# Altium project HolderDog.PrjPcb
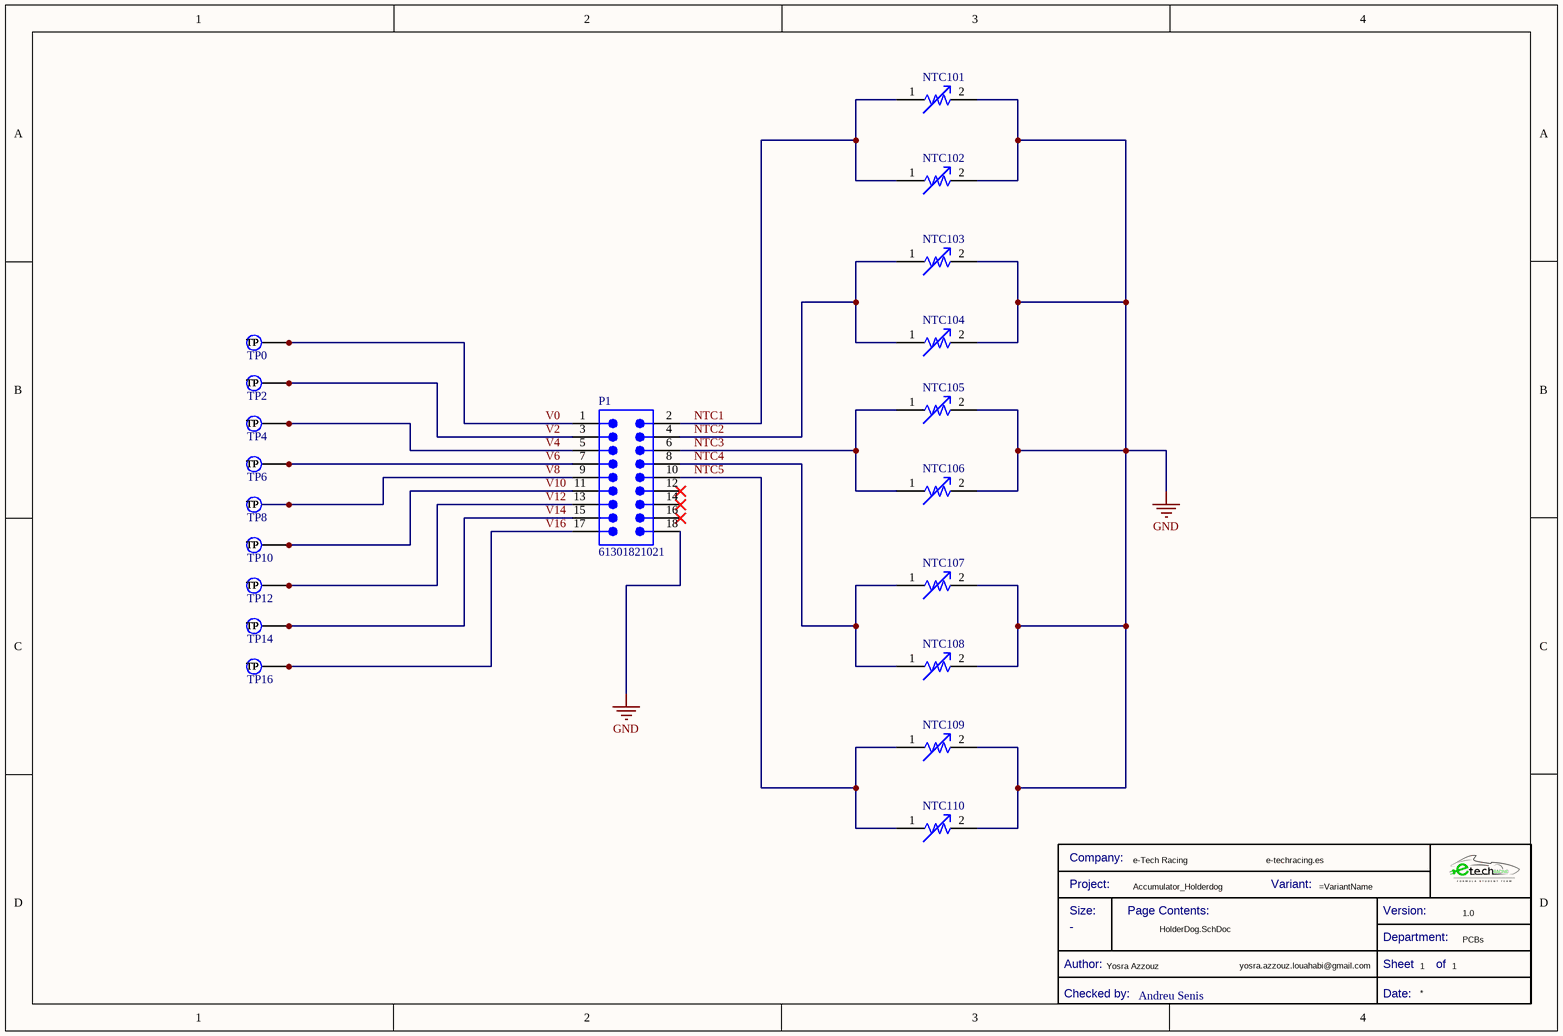
[diagram p0: HolderDog.SchDoc]
Company: e-Tech Racing; Department: PCBs; DesignedByURL: e-techracing.es; DesignerMail: yosra.azzouz.louahabi@gmail.com; DesignerName: Yosra Azzouz; Project: Accumulator_Holderdog; ReviewerName: Andreu Senis; Version: 1.0
1 sheet, 21 parts. Net scope: global (net labels, ports and power ports of the same name join across sheets).
Board file: HolderDog.PcbDoc

## Sheet HolderDog.SchDoc
size A4; SheetNumber: 1; SheetTotal: 1

### Parts
*  Checked by:: Andreu Senis  (hidden comment: Title Block_template)  (graphical)
NTC101  NTC SMD 0805  [RESC2012X10N]  (value not drawn)
NTC102  NTC SMD 0805  [RESC2012X10N]  (value not drawn)
NTC103  NTC SMD 0805  [RESC2012X10N]  (value not drawn)
NTC104  NTC SMD 0805  [RESC2012X10N]  (value not drawn)
NTC105  NTC SMD 0805  [RESC2012X10N]  (value not drawn)
NTC106  NTC SMD 0805  [RESC2012X10N]  (value not drawn)
NTC107  NTC SMD 0805  [RESC2012X10N]  (value not drawn)
NTC108  NTC SMD 0805  [RESC2012X10N]  (value not drawn)
NTC109  NTC SMD 0805  [RESC2012X10N]  (value not drawn)
NTC110  NTC SMD 0805  [RESC2012X10N]  (value not drawn)
P1  61301821021  [61301821021]
TP0  Test Point  [TESTPOINT_WIDE]  (value not drawn)
TP2  Test Point  [TESTPOINT_WIDE]  (value not drawn)
TP4  Test Point  [TESTPOINT_WIDE]  (value not drawn)
TP6  Test Point  [TESTPOINT_WIDE]  (value not drawn)
TP8  Test Point  [TESTPOINT_WIDE]  (value not drawn)
TP10  Test Point  [TESTPOINT_WIDE]  (value not drawn)
TP12  Test Point  [TESTPOINT_WIDE]  (value not drawn)
TP14  Test Point  [TESTPOINT_WIDE]  (value not drawn)
TP16  Test Point  [TESTPOINT_WIDE]  (value not drawn)

### Nets
GND: NTC101.2 NTC102.2 NTC103.2 NTC104.2 NTC105.2 NTC106.2 NTC107.2 NTC108.2 NTC109.2 NTC110.2 P1.18
NTC1: NTC101.1 NTC102.1 P1.2
NTC2: NTC103.1 NTC104.1 P1.4
NTC3: NTC105.1 NTC106.1 P1.6
NTC4: NTC107.1 NTC108.1 P1.8
NTC5: NTC109.1 NTC110.1 P1.10
V0: P1.1 TP0.1(TP)
V2: P1.3 TP2.1(TP)
V4: P1.5 TP4.1(TP)
V6: P1.7 TP6.1(TP)
V8: P1.9 TP8.1(TP)
V10: P1.11 TP10.1(TP)
V12: P1.13 TP12.1(TP)
V14: P1.15 TP14.1(TP)
V16: P1.17 TP16.1(TP)

Not connected (* = marked no-connect by the designer): P1 12* 14* 16*

### Notes on the sheet
- (in symbol Title Block_template) Company:; Project:; Variant:; Size:; Page Contents:; Version:; Department:; Author:; Sheet; of; Checked by:; Date:

### Library data of the parts
* = Title Block_template: Standard Title Block; .Creator: GP; Category: Title Block; .PCBcheck: GP; .SCHcheck: GP; Size: -
NTC101-NTC110 = CMP-010-00001-1: NTC 0805 package 10kR
P1 = CMP-002-00004-1: Board Connector, 18 Contact(s), 2 Row(s), Male, Right Angle, 0.1 inch Pitch, Solder Terminal, Locking, Black Insulator, Plug; RoHS Compliant: Yes; Mounting Technology: Board; Min Operating Temperature: -40°C; Connector Type: BOARD CONNECTOR; Max Operating Temperature: 125°C
TP0 TP2 TP4 TP6 TP8 TP10 TP12 TP14 TP16 = TestPoint_Wide: TestPoint 5x5mm